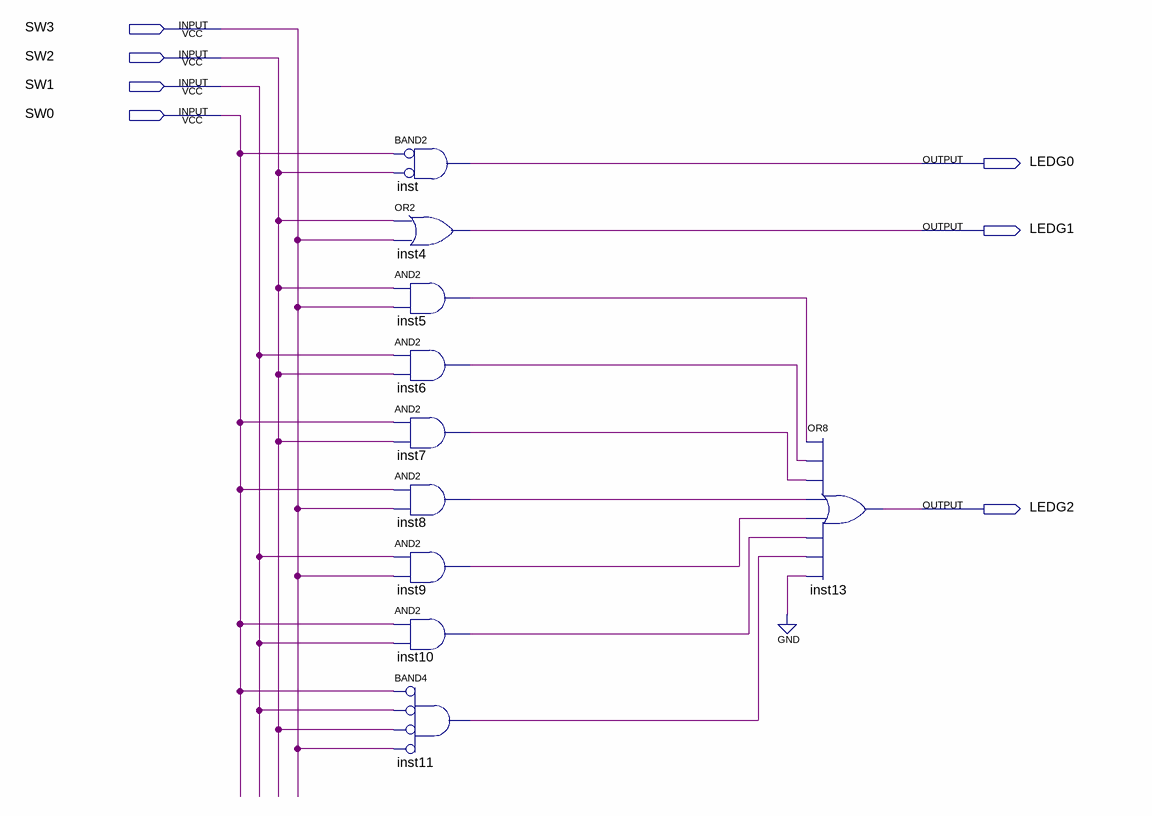
[diagram p0: schematic sheet]
// Quartus schematic Lab5.bdf as structural Verilog: 10 symbols, 7 pins
module Lab5 (
  input  SW3,
  input  SW2,
  input  SW1,
  input  SW0,
  output LEDG0,
  output LEDG1,
  output LEDG2
);

  wire inst5_out, inst6_out, inst7_out, inst8_out, inst9_out, inst10_out, inst11_out;

  and inst (LEDG0, ~SW0, ~SW2);  // BAND2
  or inst4 (LEDG1, SW2, SW3);
  and inst5 (inst5_out, SW2, SW3);
  and inst6 (inst6_out, SW1, SW2);
  and inst7 (inst7_out, SW0, SW2);
  and inst8 (inst8_out, SW0, SW3);
  and inst9 (inst9_out, SW1, SW3);
  and inst10 (inst10_out, SW0, SW1);
  and inst11 (inst11_out, ~SW0, ~SW1, ~SW2, ~SW3);  // BAND4
  or inst13 (LEDG2, inst5_out, inst6_out, inst7_out, inst8_out, inst9_out, inst10_out, inst11_out, 1'b0);
endmodule
